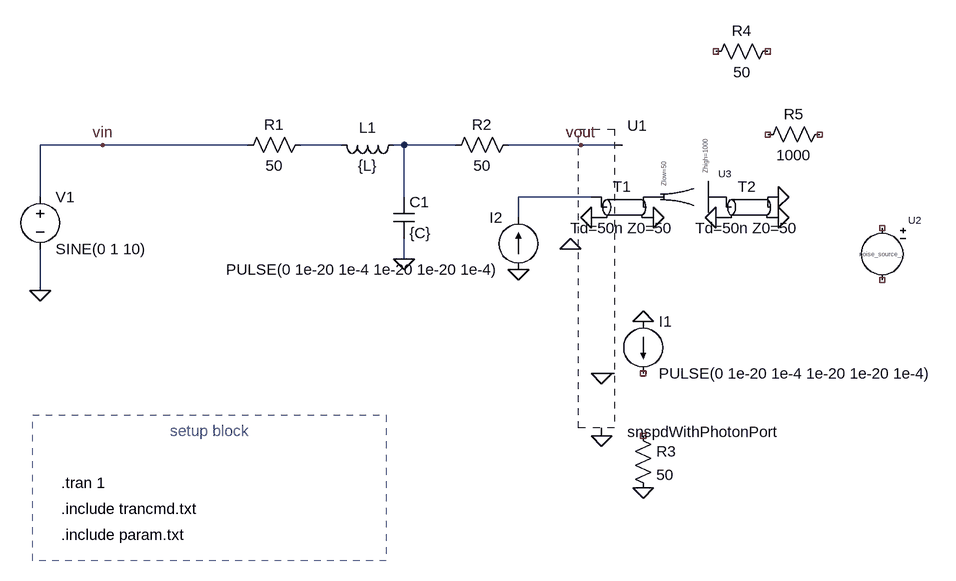
[diagram p0: schematic circuit.asc]
circuit.asc, the LTspice schematic file:
Version 4
SHEET 1 1596 740
WIRE 304 96 208 96
WIRE 528 96 304 96
WIRE 672 96 608 96
WIRE 768 96 752 96
WIRE 848 96 768 96
WIRE 1040 96 928 96
WIRE 1104 96 1040 96
WIRE 208 176 208 96
WIRE 768 176 768 96
WIRE 1056 176 944 176
WIRE 944 208 944 176
WIRE 768 272 768 240
WIRE 208 320 208 256
FLAG 304 96 vin
FLAG 208 320 0
FLAG 1040 96 vout
FLAG 768 272 0
FLAG 1072 544 0
FLAG 1072 448 0
FLAG 1136 368 0
FLAG 1136 624 0
FLAG 944 288 0
FLAG 1024 256 0
FLAG 1056 208 0
FLAG 1152 208 0
FLAG 1248 208 0
FLAG 1344 208 0
FLAG 1344 176 0
SYMBOL voltage 208 160 R0
WINDOW 39 0 0 Left 0
SYMATTR InstName V1
SYMATTR Value SINE(0 1 10)
SYMBOL res 624 80 R90
WINDOW 0 0 56 VBottom 2
WINDOW 3 32 56 VTop 2
SYMATTR InstName R1
SYMATTR Value 50
SYMBOL cap 752 176 R0
SYMATTR InstName C1
SYMATTR Value {C}
SYMBOL ind 768 80 R90
WINDOW 0 5 56 VBottom 2
WINDOW 3 32 56 VTop 2
SYMATTR InstName L1
SYMATTR Value {L}
SYMBOL res 832 112 R270
WINDOW 0 32 56 VTop 2
WINDOW 3 0 56 VBottom 2
SYMATTR InstName R2
SYMATTR Value 50
SYMBOL qnn-spice/SNSPD/snspdWithPhotonPort 1136 496 R0
SYMATTR InstName U1
SYMBOL current 1136 368 R0
SYMATTR InstName I1
SYMATTR Value PULSE(0 1e-20 1e-4 1e-20 1e-20 1e-4)
SYMBOL Res 1120 528 R0
SYMATTR InstName R3
SYMATTR Value 50
SYMBOL Res 1344 -64 R90
WINDOW 0 0 56 VBottom 2
WINDOW 3 32 56 VTop 2
SYMATTR InstName R4
SYMATTR Value 50
SYMBOL noise_source_1 1504 224 R0
SYMATTR InstName U2
SYMBOL taper_1 1200 176 R0
SYMATTR InstName U3
SYMBOL Res 1424 64 R90
WINDOW 0 0 56 VBottom 2
WINDOW 3 32 56 VTop 2
SYMATTR InstName R5
SYMATTR Value 1000
SYMBOL tline 1104 192 R0
SYMATTR InstName T1
SYMBOL tline 1296 192 R0
SYMATTR InstName T2
SYMBOL current 944 288 R180
WINDOW 0 24 80 Left 2
WINDOW 3 24 0 Left 2
SYMATTR InstName I2
SYMATTR Value PULSE(0 1e-20 1e-4 1e-20 1e-20 1e-4)
TEXT 240 616 Left 2 !.tran 1
TEXT 240 696 Left 2 !.include param.txt
TEXT 240 656 Left 2 !.include trancmd.txt
TEXT 408 536 Left 2 ;setup block
RECTANGLE Normal 740 736 196 512 2

The netlist it stands for:
* circuit.asc
V1 vin 0 SINE(0 1 10)
R1 N001 vin 50
C1 N002 0 {C}
L1 N002 N001 {L}
R2 N002 vout 50
* U1: snspdWithPhotonPort (symbol qnn-spice/SNSPD/snspdWithPhotonPort not available, pin order unknown); nets seen at it: 0, vout
I1 0 NC_01 PULSE(0 1e-20 1e-4 1e-20 1e-20 1e-4)
R3 NC_02 0 50
R4 NC_03 NC_04 50
XU2 NC_05 NC_06 noise_source_1  ; pins in out
XU3 P001 P002 taper_1  ; pins in out
R5 NC_07 NC_08 1000
T1 N003 0 P002 0 Td=50n Z0=50
T2 P001 0 0 0 Td=50n Z0=50
I2 0 N003 PULSE(0 1e-20 1e-4 1e-20 1e-20 1e-4)
.tran 1
.include param.txt
.include trancmd.txt
* setup block
.lib /Users/torque/programs/spice-daemon/.spice-daemon-data/pynoise.lib
.backanno
.end